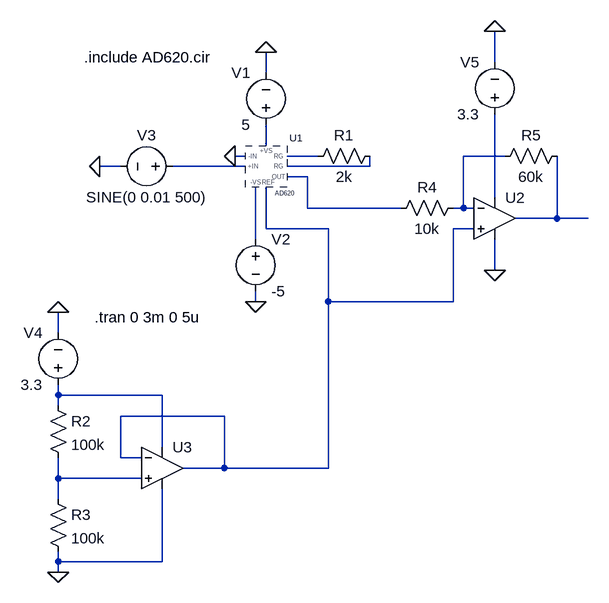
[diagram p0: schematic circuitFullGainNoFilters copy.asc]
circuitFullGainNoFilters copy.asc, the LTspice schematic file:
Version 4
SHEET 1 1360 920
WIRE 512 0 512 -48
WIRE 160 16 160 -16
WIRE 160 128 160 96
WIRE 128 144 112 144
WIRE 240 144 192 144
WIRE 528 144 464 144
WIRE -64 160 -96 160
WIRE 128 160 16 160
WIRE 320 160 320 144
WIRE 320 160 192 160
WIRE 224 176 192 176
WIRE 512 208 512 80
WIRE 224 224 224 176
WIRE 368 224 224 224
WIRE 464 224 464 144
WIRE 464 224 448 224
WIRE 480 224 464 224
WIRE 608 240 608 144
WIRE 608 240 544 240
WIRE 656 240 608 240
WIRE 160 256 160 192
WIRE 256 256 160 256
WIRE 480 256 448 256
WIRE 144 272 144 192
WIRE 512 320 512 272
WIRE 144 368 144 352
WIRE 256 368 256 256
WIRE 448 368 448 256
WIRE 448 368 256 368
WIRE -160 416 -160 384
WIRE -160 512 -160 496
WIRE 0 512 -160 512
WIRE -160 528 -160 512
WIRE 96 544 -64 544
WIRE 0 592 0 512
WIRE -64 608 -64 544
WIRE -32 608 -64 608
WIRE 96 624 96 544
WIRE 96 624 32 624
WIRE 256 624 256 368
WIRE 256 624 96 624
WIRE -160 640 -160 608
WIRE -32 640 -160 640
WIRE -160 672 -160 640
WIRE -160 768 -160 752
WIRE 0 768 0 656
WIRE 0 768 -160 768
WIRE -160 784 -160 768
FLAG 144 368 0
FLAG 160 -16 0
FLAG -96 160 0
FLAG 112 144 0
FLAG -160 384 0
FLAG -160 784 0
FLAG 512 320 0
FLAG 512 -48 0
SYMBOL res 336 128 R90
WINDOW 0 0 56 VBottom 2
WINDOW 3 32 56 VTop 2
SYMATTR InstName R1
SYMATTR Value 2k
SYMBOL Voltage 160 112 R180
WINDOW 0 24 96 Left 2
WINDOW 3 24 16 Left 2
SYMATTR InstName V1
SYMATTR Value 5
SYMBOL Voltage 144 256 R0
SYMATTR InstName V2
SYMATTR Value -5
SYMBOL Voltage 32 160 R90
WINDOW 0 -32 56 VBottom 2
WINDOW 3 32 56 VTop 2
SYMATTR InstName V3
SYMATTR Value SINE(0 0.01 500)
SYMBOL AD620 160 160 R0
WINDOW 3 14 41 Left 0
SYMATTR InstName U1
SYMBOL Res -176 512 R0
SYMATTR InstName R2
SYMATTR Value 100k
SYMBOL Res -176 656 R0
SYMATTR InstName R3
SYMATTR Value 100k
SYMBOL voltage -160 512 R180
WINDOW 0 24 96 Left 2
WINDOW 3 24 16 Left 2
SYMATTR InstName V4
SYMATTR Value 3.3
SYMBOL UniversalOpAmp 0 624 R0
SYMATTR InstName U3
SYMBOL UniversalOpAmp 512 240 R0
SYMATTR InstName U2
SYMBOL Res 464 208 R90
WINDOW 0 0 56 VBottom 2
WINDOW 3 32 56 VTop 2
SYMATTR InstName R4
SYMATTR Value 10k
SYMBOL Voltage 512 96 R180
WINDOW 0 24 96 Left 2
WINDOW 3 24 16 Left 2
SYMATTR InstName V5
SYMATTR Value 3.3
SYMBOL Res 624 128 R90
WINDOW 0 0 56 VBottom 2
WINDOW 3 32 56 VTop 2
SYMATTR InstName R5
SYMATTR Value 60k
TEXT -120 -8 Left 2 !.include AD620.cir
TEXT -104 392 Left 2 !.tran 0 3m 0 5u

The netlist it stands for:
* circuitFullGainNoFilters copy.asc
R1 N005 N002 2k
V1 N001 0 5
V2 N010 0 -5
V3 N004 0 SINE(0 0.01 500)
XU1 N004 0 N001 N010 N006 N009 N005 N002 AD620  ; pins +IN -IN +VS -VS OUT REF RG1 RG
R2 N011 N012 100k
R3 N012 0 100k
V4 N011 0 3.3
XU3 N012 N009 N011 0 N009 level1 Avol=1Meg GBW=10Meg Vos=0 En=0 Enk=0 In=0 Ink=0 Rin=500Meg  ; pins In+ In- V+ V- OUT
XU2 N009 N003 N007 0 N008 level1 Avol=1Meg GBW=10Meg Vos=0 En=0 Enk=0 In=0 Ink=0 Rin=500Meg  ; pins In+ In- V+ V- OUT
R4 N003 N006 10k
V5 N007 0 3.3
R5 N008 N003 60k
.include AD620.cir
.tran 0 3m 0 5u
.lib UniversalOpAmp1.lib
.backanno
.end